# Altium schematic sheet sumoLab.SchDoc
size A
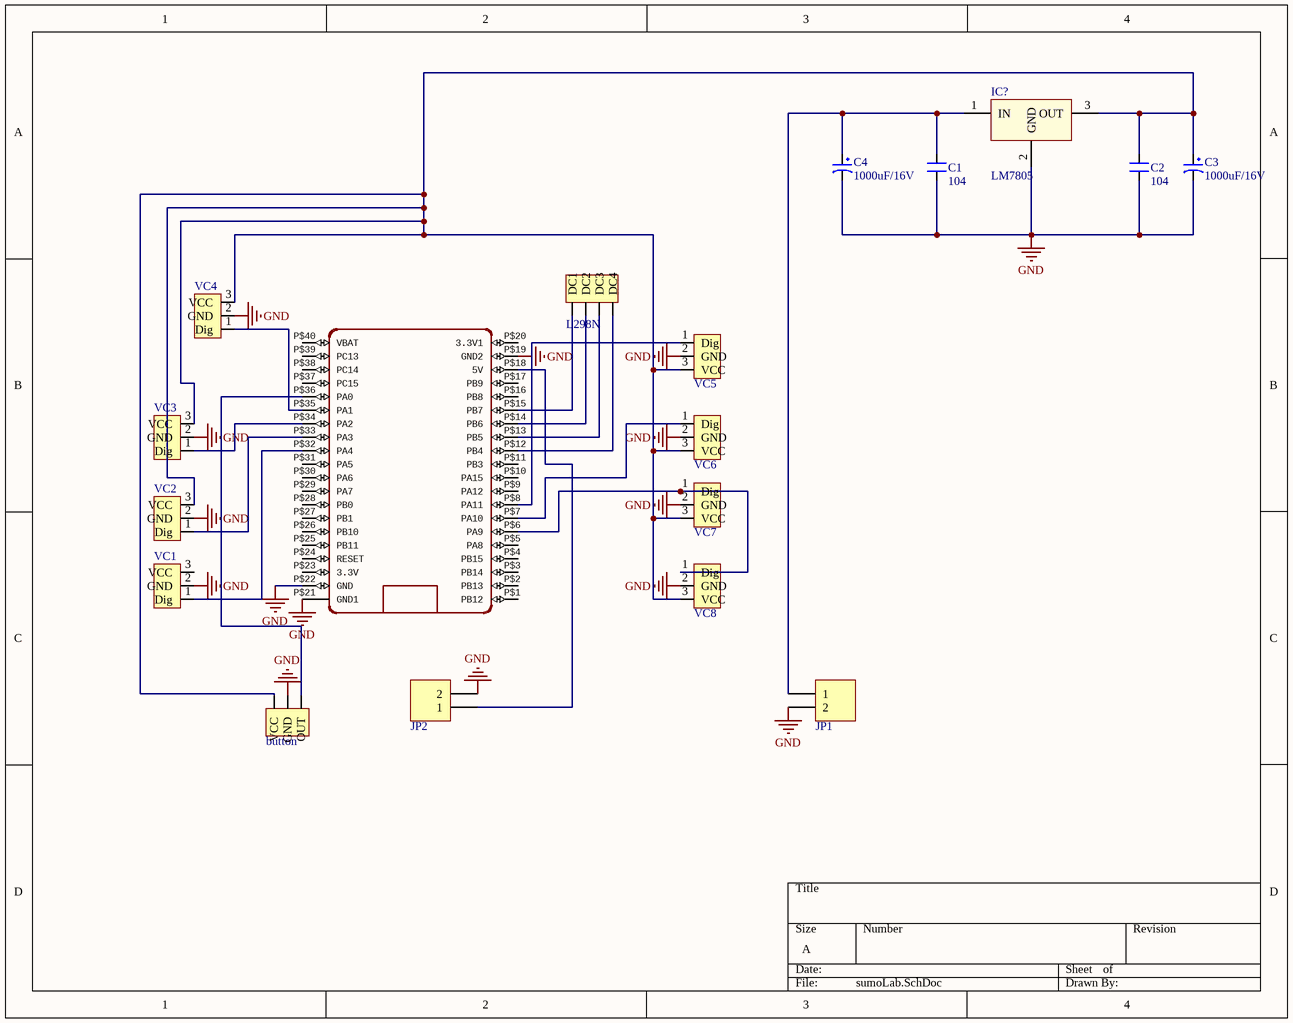
[diagram p0: sumoLab.SchDoc]

## Parts
button  Button  [Header3]  (value not drawn)
C1  104  [CN2]
C2  104  [CN2]
C3  1000uF/16V  [CP1.5/3.4]
C4  1000uF/16V  [CP1.5/3.4]
IC?  LM7805  [QTO-220]
JP1  Header 2_1  [HED2]  (value not drawn)
JP2  Header 2_1  [HED2]  (value not drawn)
L298N  (no value)  [Header4]
u  BLUE_PILL  [BLUE_PILL]  (value not drawn)
VC1  VC1  [Header3]  (value not drawn)
VC2  VC2  [Header3]  (value not drawn)
VC3  VC3  [Header3]  (value not drawn)
VC4  VC4  [Header3]  (value not drawn)
VC5  VC4  [Header3]  (value not drawn)
VC6  VC4  [Header3]  (value not drawn)
VC7  VC4  [Header3]  (value not drawn)
VC8  VC4  [Header3]  (value not drawn)

## Nets
GND: button.2(GND) C1.1 C2.1 C3.2 C4.2 IC?.2(GND) JP1.2 JP2.2 u.P$19(GND2) u.P$21(GND1) u.P$22(GND) VC1.2(GND) VC2.2(GND) VC3.2(GND) VC4.2(GND) VC5.2(GND) VC6.2(GND) VC7.2(GND) VC8.2(GND)
Netbutton_1: button.1(OUT) u.P$36(PA0)
Netbutton_3: button.3(VCC) C2.2 C3.1 IC?.3(OUT) VC2.3(VCC) VC3.3(VCC) VC4.3(VCC) VC5.3(VCC) VC6.3(VCC) VC7.3(VCC) VC8.3(VCC)
NetC1_2: C1.2 C4.1 IC?.1(IN) JP1.1
NetJP2_1: JP2.1 u.P$18(5V)
NetL298N_1: L298N.1(DC1) u.P$15(PB7)
NetL298N_2: L298N.2(DC2) u.P$14(PB6)
NetL298N_3: L298N.3(DC3) u.P$13(PB5)
NetL298N_4: L298N.4(DC4) u.P$12(PB4)
Netu_P$6: u.P$6(PA9) VC7.1(Dig) VC8.1(Dig)
Netu_P$7: u.P$7(PA10) VC6.1(Dig)
Netu_P$8: u.P$8(PA11) VC5.1(Dig)
Netu_P$32: u.P$32(PA4) VC1.1(Dig)
Netu_P$33: u.P$33(PA3) VC2.1(Dig)
Netu_P$34: u.P$34(PA2) VC3.1(Dig)
Netu_P$35: u.P$35(PA1) VC4.1(Dig)

Not connected (* = marked no-connect by the designer): u P$1(PB12) P$2(PB13) P$3(PB14) P$4(PB15) P$5(PA8) P$9(PA12) P$10(PA15) P$11(PB3) P$16(PB8) P$17(PB9) P$20(3.3V1) P$23(3.3V) P$24(RESET) P$25(PB11) P$26(PB10) P$27(PB1) P$28(PB0) P$29(PA7) P$30(PA6) P$31(PA5) P$37(PC15) P$38(PC14) P$39(PC13) P$40(VBAT); VC1 3(VCC)

## Library data of the parts
button VC1-VC8 = Header3: Header IDC, 3 x 1 Pin Vertical 2.54mm Pitch (Non-Boxed, Male); Manufacturer: W¨¹rth Elektronik eiSos GmbH; partNo: 613002143121; ComponentLink1 Description: Manufacturer; ComponentLink2 Description: Datasheet; NoPins: 02; Created Date: 29 March 2013; ComponentLink1URL: http://www.we-online.com; ComponentLink2URL: http://katalog.we-online.de/em/datasheet/6130xx143121.pdf; Created by: Karrer Zheng
C1 C2 = CN2: Cap np 104 => 105pF; Value: 0.1uF
C3 C4 = CP3: Cap 100uF/35V - 470uF/16V; Value: 100uF/35V/50V; Description 1: 1000uF/6,3V - 470uF/16V - 330uF - 25V; Description 2: 220uF/35V - 100uF/50V - 63V - 4,7uF/200V; Description 3: 22uF => 33uF100V - 3,3uF => 4,7uF/250V; Description 4: 2,2uF =>3,3uF/350 - 2,2uF/400V - 1uF/450V
IC? = LM78xx: On ap +, from + 5 to + 24VDC; Value: LM7805
JP1 JP2 = Header 2_1: Header, 2-Pin; Manufacturer: Generic Components; Class: Connector; Value: Header 2
L298N = Header4: Header IDC, 4 x 1 Pin Vertical 2.54mm Pitch (Non-Boxed, Male); Manufacturer: W¨¹rth Elektronik eiSos GmbH; partNo: 613002143121; ComponentLink1 Description: Manufacturer; ComponentLink2 Description: Datasheet; NoPins: 02; Created Date: 29 March 2013; ComponentLink1URL: http://www.we-online.com; ComponentLink2URL: http://katalog.we-online.de/em/datasheet/6130xx143121.pdf; Created by: Karrer Zheng
u = BLUE_PILL: GateName_1: G$1; SymbolName_1: BLUE_PILL; LibraryName: BluePill; DeviceSetName: BLUE_PILL; Package: BLUE_PILL